# Altium schematic sheet RELAY.SchDoc
size A; SheetNumber: 6; SheetTotal: 9
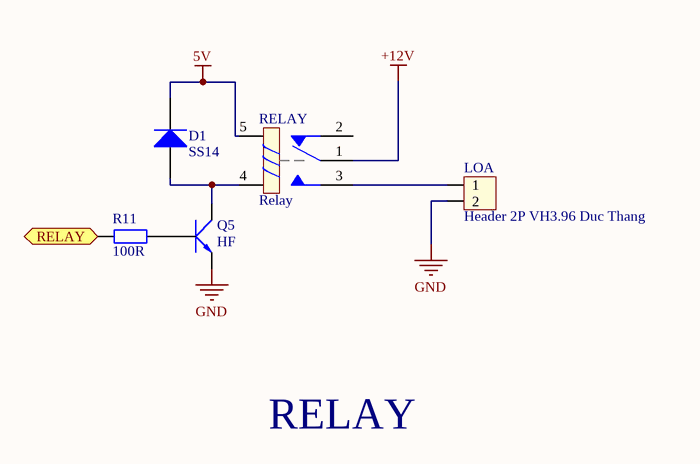
[diagram p0: RELAY.SchDoc]

## Parts
D1  SS14  [DIODE SMA]
LOA  Header 2P VH3.96 Duc Thang  [VH3.96M-2]
Q5  HF  [SOT23]
R11  100R  [tro smd 0603]
RELAY  Relay  [Relay 5 Chan SRD]

## Ports
RELAY (bidir)

## Nets
5V: D1.2(K) RELAY.5
+12V: RELAY.1
GND: LOA.2 Q5.2(E)
RELAY: R11.1 ; port RELAY
NetD1_1: D1.1(A) Q5.3(C) RELAY.4
NetLOA_1: LOA.1 RELAY.3
NetQ5_1: Q5.1(B) R11.2

Not connected (* = marked no-connect by the designer): RELAY 2

## Notes on the sheet
- RELAY

## Library data of the parts
D1 = Diode SS14 ( 1N5819): Dán; Ma_Hang: MH002211; Don_Vi: Con; Ten_Linh_Kien: Diode SS14 DO214 Schottky 1A 40V ( 1N5819 DO214); Chung_Loai: Dán; Ghi_Chu: *; Kieu_Chan: *
LOA = Header 2P VH3.96 Duc Thang: Cắm; Ten_Linh_Kien: Header 2P XH2.54-2P Đực Thẳng; Don_Vi: Con; Ma_Hang: MH001283; Chung_Loai: Cắm
Q5 = C1815 HF SMD: NPN transistor; Value: C9014
R11 = Tro 0603 5% 100R: Dán; Don_Vi: Con; So_Chan: 2; Ten_Linh_Kien: Trở 0603 5% 100R; Ma_Hang: MH006315; Chung_Loai: Dán; Kieu_Chan: *
RELAY = Relay 5 Chan SRD: Relay 5 Chan; Ma_Hang: MH009374; Ten: Relay 5V10A SRD-05VDC-SL-C Chính Hãng